# EAGLE design Zio Qwiic Soil Moisture Sensor (EAGLE 9.1.1)
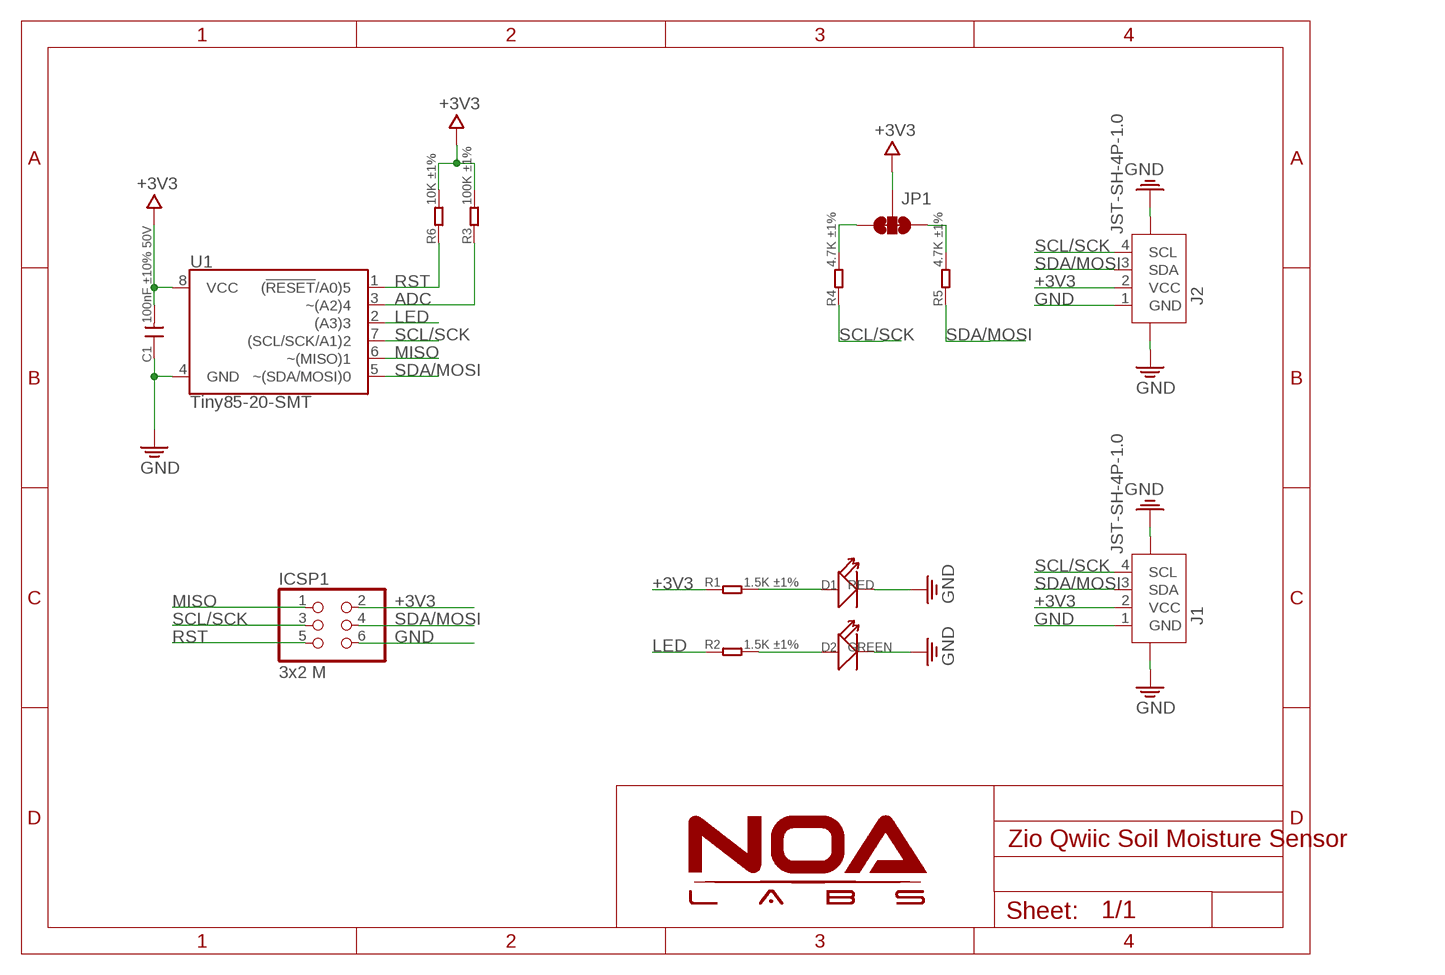
[diagram p0: schematic, sheet 1]

## Parts
C1  100nF ±10% 50V  C-0603  [C0603]
D1  RED  LED'0603'  [LED-0603]
D2  GREEN  LED'0603'  [LED-0603]
ICSP1  3x2 M  PINHD-2X3  [2X03]
J1  JST-SH-4P-1.0  [JST-SH-4P]
J2  JST-SH-4P-1.0  [JST-SH-4P]
JP1  SMT-JUMPER_3_2-NC_TRACE  [SMT-JUMPER_3_2-NC_TRACE]
R1  1.5K ±1%  R-0603  [R0603]
R2  1.5K ±1%  R-0603  [R0603]
R3  100K ±1%  R-0603  [R0603]
R4  4.7K ±1%  R-0603  [R0603]
R5  4.7K ±1%  R-0603  [R0603]
R6  10K ±1%  R-0603  [R0603]
U1  Tiny85-20-SMT  ATTINY85-ARDUINOTINY85-20-SMT  [SO08-EIAJ_MCU]

## Nets
+3V3: C1.2 ICSP1.2 J1.2(VCC) J2.2(VCC) JP1.2 R1.1 R3.2 R6.2 U1.8(VCC)
ADC: R3.1 U1.3(~(A2)4)
GND: C1.1 D1.- D2.- ICSP1.6 J1.1(GND) J1.NC1 J1.NC2 J2.1(GND) J2.NC1 J2.NC2 U1.4(GND)
LED: R2.1 U1.2((A3)3)
MISO: ICSP1.1 U1.6(~(MISO)1)
N$1: D1.+ R1.2
N$2: D2.+ R2.2
N$6: JP1.3 R4.2
N$8: JP1.1 R5.2
RST: ICSP1.5 R6.1 U1.1((!RESET!/A0)5)
SCL/SCK: ICSP1.3 J1.4(SCL) J2.4(SCL) R4.1 U1.7((SCL/SCK/A1)2)
SDA/MOSI: ICSP1.4 J1.3(SDA) J2.3(SDA) R5.1 U1.5(~(SDA/MOSI)0)

## Library data of the parts
C1 = RCL:C
D1 D2 = Discrete_NOA:LED*
ICSP1 = SmartPrj:PINHD-2X3: PIN HEADER
J1 J2 = Connector:JST-SH-4P
JP1 = NOA-Jumpers:SMT-JUMPER_3_2-NC_TRACE
R1-R6 = RCL:R
U1 = Qwiic-Bluetooth-HC1x:ATTINY85-ARDUINO: Atmel 8-pin 2/4/8kB flash uC; PROD_ID: IC-09092

## Net classes
2 gnd: width 0.254 mm, drill 0.305 mm, clearance 0.178 mm
3 usbvcc: width 0.254 mm, drill 0.381 mm, clearance 0.178 mm

## Board
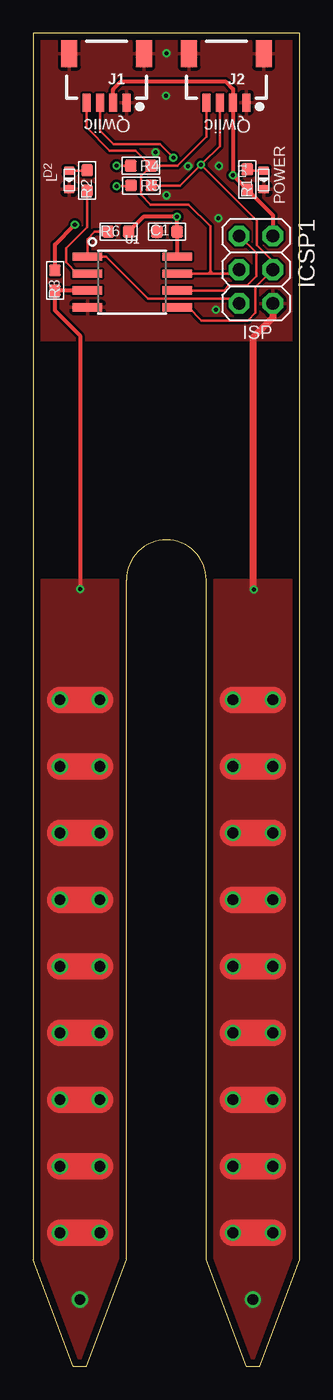
[diagram p1: board, top side]
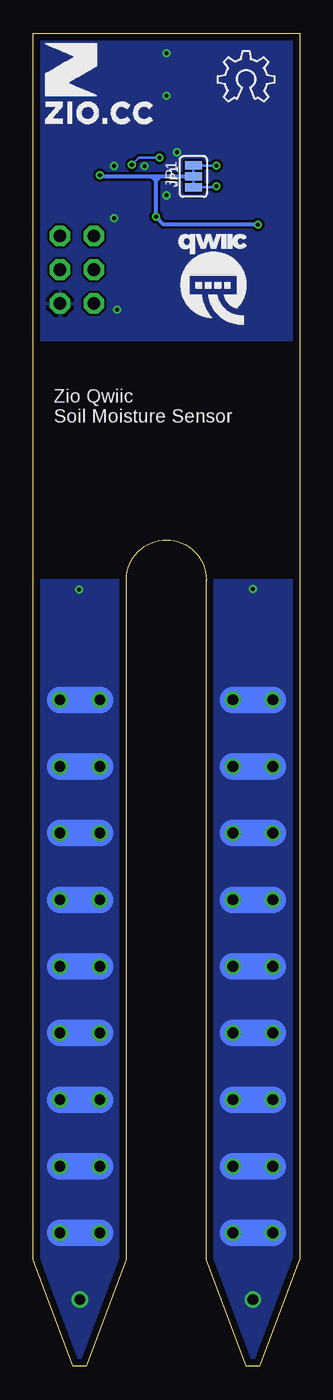
[diagram p2: board, bottom side, seen from below]

Size 20 x 100 mm. Coordinates in mm from the lower left corner, seen from the top.
Outline: 3,0 4,0 7,8 7,59 arc-180 13,59 13,8 16,0 17,0 20,8 20,100 0,100 0,8 3,0
Copper layers (1*16): Top 0.035mm / dielectric 1.5mm / Bottom 0.035mm
Design rules "NOA Eagle Rule": minimum track width 7mil, minimum drill 12mil, track to track 7mil, track to pad 7mil, pad to pad 7mil, via to via 7mil, smd to smd 0mil, copper to edge 20mil, drill to drill 10mil, minimum pad ring 10mil, minimum via ring 6mil, stop-mask expansion 2mil, vias tented up to drill 25mil, thermal gap 10mil

### Footprints (pad centres in the part's own frame; a part is rotated, then mirrored left to right if it is on the bottom)
C0603 = smd 0.889 x 0.889: 1 -0.762,0; 2 0.762,0
LED-0603 = smd 0.635 x 0.8: + 0.699,0; - -0.699,0
2X03 = drill 0.95 pad 1.55 octagon: 1 -2.54,-1.27; 2 -2.54,1.27; 3 0,-1.27; 4 0,1.27; 5 2.54,-1.27; 6 2.54,1.27
JST-SH-4P = smd 0.6 x 1.35: 1 1.5,0; 2 0.5,0; 3 -0.5,0; 4 -1.5,0 | smd 1.2 x 2: NC1 -2.8,3.675; NC2 2.8,3.675
SMT-JUMPER_3_2-NC_TRACE = smd 0.635 x 1.27: 1 -0.813,0; 2 0,0; 3 0.813,0
R0603 = smd 0.889 x 0.889: 1 -0.762,0; 2 0.762,0
SO08-EIAJ_MCU = smd 0.61 x 2.21: 1 -1.905,-3.378; 2 -0.635,-3.378; 3 0.635,-3.378; 4 1.905,-3.378; 5 1.905,3.353; 6 0.635,3.353; 7 -0.635,3.353; 8 -1.905,3.353

### Placement (x,y rotation side)
C1  10.04,85.12 0 top
D1  17.3,89 90 top
D2  2.7,89 90 top
ICSP1  16.73,82.27 270 top
J1  5.5,94.8 0 top
J2  14.5,94.8 0 top
JP1  7.97,89.26 90 bottom
R1  16.07,89.04 90 top
R2  4.04,88.96 90 top
R3  1.63,81.45 90 top
R4  8.08,90.06 180 top
R5  8.1,88.58 180 top
R6  6.4,85.12 0 top
U1  7.45,81.35 270 top
U$2  [6MM]  19.13,93.22 0 bottom
U$3  [QWIIC-LOGO-MEDIUM]  6.53,81.61 0 bottom
U$4  [OSHW_6X150_NOTEXT]  6.15,94.87 0 bottom

### Tracks (layer width: path | path; a pad name or v marks a point on that pad's centre or on a via)
+3V3  (via drill 0.3)
  Top 0.305: ICSP1.2 18,86.35 R1.1 v15,89.35 15,94.51 J2.2 15,95.82 14.43,96.39 6.6,96.39 6,95.79 J1.2 | U1.8 C1.2 10.8,86.22 v10.79,86.23 8.28,86.23 R6.2 | R3.2 1.63,84.15 v3.12,85.65
  Bottom 0.305: JP1.2 10.54,89.26 | 10.54,89.26 11.12,89.26 | 11.12,89.26 14.91,89.26 v15,89.35 | 10.79,88.93 v10.79,86.23 10.21,85.65 v3.12,85.65 | 10.79,88.93 11.12,89.26 | 10.79,88.93 10.54,89.18 10.54,89.26
ADC  (via drill 0.3, 0.81)
  Top 0.305: U1.3 1.63,80.71 | R3.1 1.63,79.2 3.5,77.33 v3.5,58.32
  Top 0.508: 1.63,80.71 R3.1
  Top 2: v5,50 v2,50 | v5,45 v2,45 | v5,40 v2,40 | v5,30 v2,30 | v5,25 v2,25 | v5,20 v2,20 | v2,10 v5,10 | v2,15 v5,15 | v2,35 v5,35
  Bottom 2: v2,25 v5,25 | v2,20 v5,20 | v2,30 v5,30 | v2,40 v5,40 | v2,45 v5,45 | v2,50 v5,50 | v2,35 v5,35 | v2,15 v5,15 | v2,10 v5,10
  other vias: 3.5,5
  pour Top (no thermals): 2.5,59 0,59 0,44.5 0,8 3,0 4,0 7,8 7,59 4.5,59
  pour Bottom (no thermals): 2.5,59 0,59 0,8 3,0 4,0 7,8 7,59 4.5,59
GND  (via drill 0.3, 0.81)
  Top 0.508: ICSP1.6 18,78.66 16.5,77.17 16.5,58.33 v16.56,58.27
  Top 2: v15,10 v18,10 | v15,15 v18,15 | v15,20 v18,20 | v15,25 v18,25 | v15,30 v18,30 | v15,35 v18,35 | v15,40 v18,40 | v15,45 v18,45 | v15,50 v18,50
  Bottom 2: v15,50 v18,50 | v15,45 v18,45 | v15,40 v18,40 | v15,35 v18,35 | v15,30 v18,30 | v15,25 v18,25 | v15,20 v18,20 | v15,15 v18,15 | v15,10 v18,10
  other vias: 16.5,5 13.72,79.28 13.92,86.14 10.01,87.84 13.94,90.05 9.19,91.07 11.63,90.03 10.01,98.51 9.98,95.31
  pour Top: 0,77 19.99,77 19.99,100 0,100
  pour Bottom: 0,77 19.99,77 19.99,100 0,100
  pour Top (no thermals): 15,59 13,59 13,8 16,0 17,0 20,8 20,59 18,59
  pour Bottom (no thermals): 13,59 20,59 20,8 17,0 16,0 13,8
LED
  Top 0.203: R2.1 4.04,85.45 2.46,83.87 2.46,82.83 3.31,81.98 U1.2
MISO
  Top 0.203: U1.6 14.31,80.71 14.66,81.05 16.03,81.05 16.74,81.76 16.74,83.53 ICSP1.1
N$1
  Top 0.203: D1.+ 16.17,89.7 R1.2
N$2
  Top 0.203: D2.+ 4.02,89.7 R2.2
N$6  (via drill 0.3)
  Top 0.203: R4.2 v6.25,90.06 v6.25,90.07
  Bottom 0.203: JP1.3 v6.25,90.07
N$8  (via drill 0.3)
  Top 0.203: R5.2 7.3,88.54 v6.25,88.54
  Bottom 0.203: JP1.1 6.35,88.44 v6.25,88.54
RST
  Top 0.203: ICSP1.5 15.1,80.09 8.64,80.09 5.47,83.25 U1.1 4.07,84.56 4.62,85.11 R6.1
SCL/SCK
  Top 0.203: U1.7 13.11,81.98 | 13.11,81.98 13.23,81.98 13.46,81.98 | 13.46,81.98 15.17,81.98 ICSP1.3 | 13.29,82.16 13.11,81.98 | 13.29,82.16 13.29,82.15 13.46,81.98 | J2.4 13,92.35 13,92.24 10.82,90.06 R4.1 | 13.29,82.16 13.29,85.37 13.29,85.52 11.65,87.16 8.8,87.16 8.08,87.88 8.08,89.3 R4.1 | R4.1 7.7,91.21 5.74,91.21 4,92.95 J1.4
SDA/MOSI  (via drill 0.3)
  Top 0.203: U1.5 11.67,79.44 12.65,78.46 16.1,78.46 16.69,79.05 16.69,80.96 ICSP1.4 18,82.92 16.79,84.12 16.79,85.95 12.72,90.02 | 12.72,90.27 v12.6,90.15 12.46,90 | 12.72,90.27 14,91.55 J2.3 | J1.3 5,92.69 6.02,91.67 9.53,91.67 v10.52,90.68 | 12.46,90 11.04,88.58 R5.1 | 12.72,90.02 12.72,90.27 | 12.72,90.02 12.47,90.02 12.46,90
  Bottom 0.203: v10.52,90.68 12.07,90.68 v12.6,90.15

### Text on the board
tPlace: Qwiic | Qwiic | L | POWER | ISP
bPlace: JP1 | Zio Qwiic / Soil Moisture Sensor